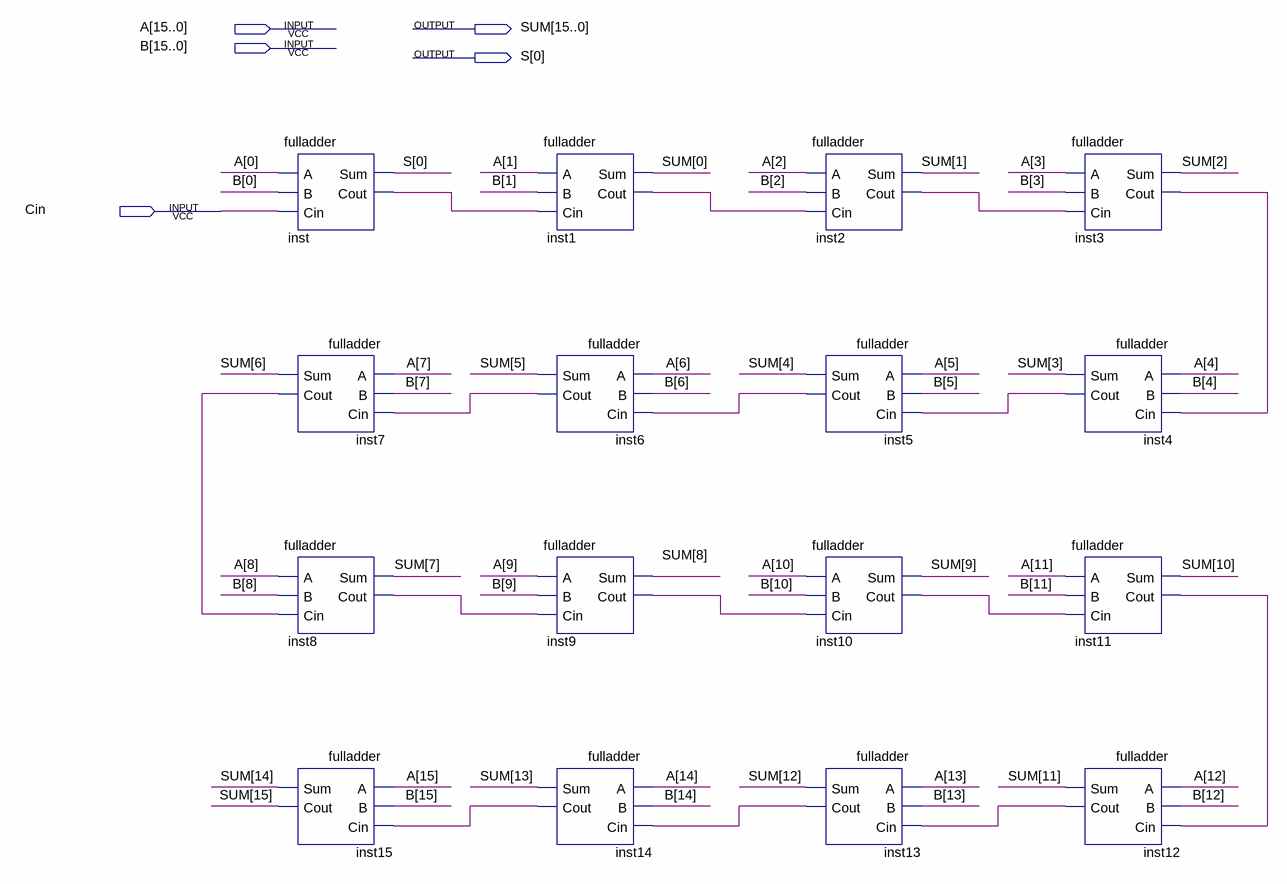
[diagram p0: schematic sheet]
// Quartus schematic ADD-SUB-MUL.bdf as structural Verilog: 16 symbols, 5 pins
module \ADD-SUB-MUL  (
  input  [15:0] A,
  input  [15:0] B,
  input  Cin,
  output [15:0] SUM,
  output [0:0] S
);

  wire inst1_cout, inst2_cout, inst3_cout, inst4_cout, inst5_cout, inst6_cout, inst7_cout, inst8_cout,
       inst9_cout, inst10_cout, inst11_cout, inst12_cout, inst13_cout, inst14_cout, inst_cout;

  fulladder inst (.A(A[0]), .B(B[0]), .Cin(Cin), .Sum(S[0]), .Cout(inst_cout));
  fulladder inst7 (.A(A[7]), .B(B[7]), .Cin(inst6_cout), .Sum(SUM[6]), .Cout(inst7_cout));
  fulladder inst8 (.A(A[8]), .B(B[8]), .Cin(inst7_cout), .Sum(SUM[7]), .Cout(inst8_cout));
  fulladder inst15 (.A(A[15]), .B(B[15]), .Cin(inst14_cout), .Sum(SUM[14]), .Cout(SUM[15]));
  fulladder inst1 (.A(A[1]), .B(B[1]), .Cin(inst_cout), .Sum(SUM[0]), .Cout(inst1_cout));
  fulladder inst6 (.A(A[6]), .B(B[6]), .Cin(inst5_cout), .Sum(SUM[5]), .Cout(inst6_cout));
  fulladder inst9 (.A(A[9]), .B(B[9]), .Cin(inst8_cout), .Sum(SUM[8]), .Cout(inst9_cout));
  fulladder inst14 (.A(A[14]), .B(B[14]), .Cin(inst13_cout), .Sum(SUM[13]), .Cout(inst14_cout));
  fulladder inst2 (.A(A[2]), .B(B[2]), .Cin(inst1_cout), .Sum(SUM[1]), .Cout(inst2_cout));
  fulladder inst5 (.A(A[5]), .B(B[5]), .Cin(inst4_cout), .Sum(SUM[4]), .Cout(inst5_cout));
  fulladder inst10 (.A(A[10]), .B(B[10]), .Cin(inst9_cout), .Sum(SUM[9]), .Cout(inst10_cout));
  fulladder inst13 (.A(A[13]), .B(B[13]), .Cin(inst12_cout), .Sum(SUM[12]), .Cout(inst13_cout));
  fulladder inst3 (.A(A[3]), .B(B[3]), .Cin(inst2_cout), .Sum(SUM[2]), .Cout(inst3_cout));
  fulladder inst4 (.A(A[4]), .B(B[4]), .Cin(inst3_cout), .Sum(SUM[3]), .Cout(inst4_cout));
  fulladder inst11 (.A(A[11]), .B(B[11]), .Cin(inst10_cout), .Sum(SUM[10]), .Cout(inst11_cout));
  fulladder inst12 (.A(A[12]), .B(B[12]), .Cin(inst11_cout), .Sum(SUM[11]), .Cout(inst12_cout));
endmodule
